# EAGLE schematic upper (EAGLE 9.6.2)
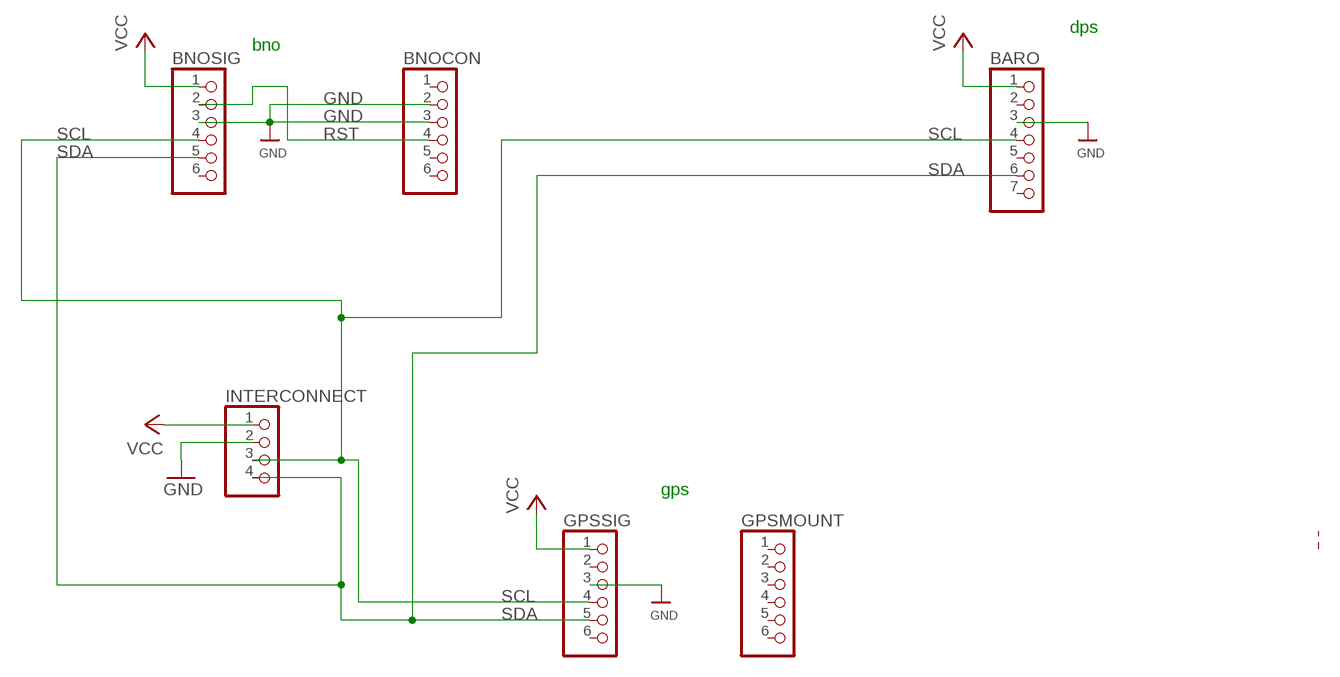
[diagram p0: schematic, sheet 1]

## Parts
BARO  HEADER-1X770MIL  [1X07_ROUND_70]
BNOCON  HEADER-1X670MIL  [1X06_ROUND_70]
BNOSIG  HEADER-1X670MIL  [1X06_ROUND_70]
GPSMOUNT  HEADER-1X670MIL  [1X06_ROUND_70]
GPSSIG  HEADER-1X670MIL  [1X06_ROUND_70]
INTERCONNECT  PINHD-1X4  [1X04]

## Nets
GND [lowpower]: BARO.3 BNOCON.2 BNOCON.3 BNOSIG.3 GPSSIG.3 INTERCONNECT.2
RST: BNOCON.4 BNOSIG.2
SCL: BARO.4 BNOSIG.4 GPSSIG.4 INTERCONNECT.3
SDA: BARO.6 BNOSIG.5 GPSSIG.5 INTERCONNECT.4
VCC [lowpower]: BARO.1 BNOSIG.1 GPSSIG.1 INTERCONNECT.1
Unconnected: BARO.2 BARO.5 BARO.7 BNOCON.1 BNOCON.5 BNOCON.6 BNOSIG.6 GPSMOUNT.1 GPSMOUNT.2 GPSMOUNT.3 GPSMOUNT.4 GPSMOUNT.5 GPSMOUNT.6 GPSSIG.2 GPSSIG.6

## Notes on the sheet
- dps
- bno
- gps

## Library data of the parts
BARO = microbuilder:HEADER-1X7: PIN HEADER
BNOCON BNOSIG GPSMOUNT GPSSIG = microbuilder:HEADER-1X6: PIN HEADER
INTERCONNECT = pinhead:PINHD-1X4: PIN HEADER

## Net classes
1 highpower: width 0.406 mm, drill 0.483 mm
2 lowpower: width 0.305 mm, drill 0.483 mm